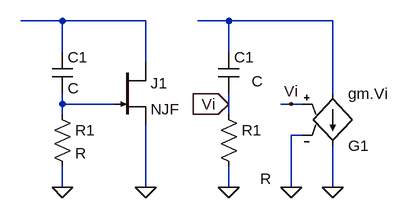
[diagram p0: schematic FET_reac_des.asc]
FET_reac_des.asc, the LTspice schematic file:
Version 4
SHEET 1 880 680
WIRE 64 32 0 32
WIRE 192 32 64 32
WIRE 320 32 272 32
WIRE 480 32 320 32
WIRE 64 80 64 32
WIRE 320 80 320 32
WIRE 192 96 192 32
WIRE 480 144 480 32
WIRE 64 160 64 144
WIRE 144 160 64 160
WIRE 320 160 320 144
WIRE 416 160 400 160
WIRE 432 160 416 160
WIRE 64 176 64 160
WIRE 320 176 320 160
WIRE 432 208 416 208
WIRE 64 288 64 256
WIRE 192 288 192 192
WIRE 320 288 320 256
WIRE 416 288 416 208
WIRE 480 288 480 224
FLAG 64 288 0
FLAG 192 288 0
FLAG 320 288 0
FLAG 480 288 0
FLAG 416 288 0
FLAG 416 160 Vi
FLAG 320 160 Vi
IOPIN 320 160 In
SYMBOL cap 48 80 R0
SYMATTR InstName C1
SYMBOL res 48 160 R0
SYMATTR InstName R1
SYMBOL njf 144 96 R0
SYMATTR InstName J1
SYMBOL cap 304 80 R0
WINDOW 3 51 45 Left 2
SYMATTR InstName C1
SYMBOL res 304 160 R0
WINDOW 3 64 115 Left 2
SYMATTR InstName R1
SYMBOL g2 480 240 M180
SYMATTR InstName G1
SYMATTR Value gm.Vi

The netlist it stands for:
* FET_reac_des.asc
C1 N001 N003 C
R1 N003 0 R
J1 N001 N003 0 NJF
C1 N002 Vi C
R1 Vi 0 R
G1 N002 0 Vi 0 gm.Vi
.model NJF NJF
.model PJF PJF
.lib standard.jft
.backanno
.end